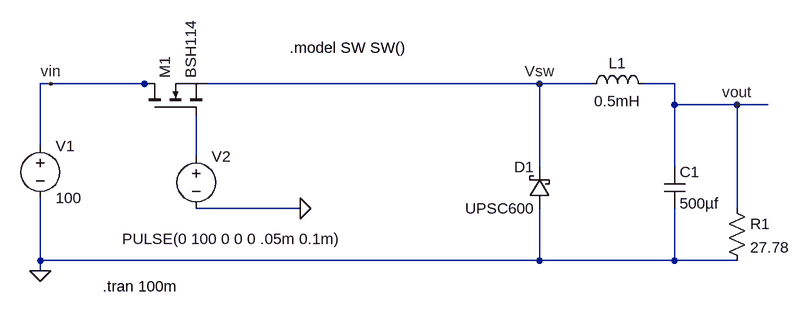
[diagram p0: schematic buck converter.asc]
buck converter.asc, the LTspice schematic file:
Version 4
SHEET 1 880 680
WIRE -1408 -1056 -1424 -1056
WIRE -1264 -1056 -1408 -1056
WIRE -1248 -1056 -1264 -1056
WIRE -656 -1056 -1168 -1056
WIRE -576 -1056 -656 -1056
WIRE -448 -1056 -496 -1056
WIRE -448 -1024 -448 -1056
WIRE -352 -1024 -448 -1024
WIRE -304 -1024 -352 -1024
WIRE -1424 -960 -1424 -1056
WIRE -1184 -944 -1184 -1008
WIRE -656 -928 -656 -1056
WIRE -448 -928 -448 -1024
WIRE -1024 -864 -1184 -864
WIRE -352 -864 -352 -1024
WIRE -1424 -784 -1424 -880
WIRE -656 -784 -656 -864
WIRE -656 -784 -1424 -784
WIRE -448 -784 -448 -864
WIRE -448 -784 -656 -784
WIRE -352 -784 -448 -784
WIRE -1424 -768 -1424 -784
FLAG -1424 -768 0
FLAG -1408 -1056 vin
FLAG -352 -1024 vout
FLAG -656 -1056 Vsw
FLAG -1024 -864 0
SYMBOL res -368 -880 R0
SYMATTR InstName R1
SYMATTR Value 27.78
SYMATTR SpiceLine tol=1 pwr=0.1
SYMBOL cap -464 -928 R0
SYMATTR InstName C1
SYMATTR Value 500µf
SYMBOL voltage -1424 -976 R0
WINDOW 123 0 0 Left 0
WINDOW 39 0 0 Left 0
SYMATTR InstName V1
SYMATTR Value 100
SYMBOL ind -592 -1040 R270
WINDOW 0 32 56 VTop 2
WINDOW 3 5 56 VBottom 2
SYMATTR InstName L1
SYMATTR Value 0.5mH
SYMBOL schottky -640 -864 R180
WINDOW 0 24 64 Left 2
WINDOW 3 24 0 Left 2
SYMATTR InstName D1
SYMATTR Value UPSC600
SYMATTR Description Diode
SYMATTR Type diode
SYMBOL voltage -1184 -960 R0
WINDOW 123 0 0 Left 0
WINDOW 39 0 0 Left 0
WINDOW 3 -114 143 Left 2
SYMATTR InstName V2
SYMATTR Value PULSE(0 100 0 0 0 .05m 0.1m)
SYMBOL nmos -1264 -1008 R270
SYMATTR InstName M1
SYMATTR Value BSH114
TEXT -1328 -744 Left 2 !.tran 100m
TEXT -1040 -1112 Left 2 !.model SW SW()

The netlist it stands for:
* buck converter.asc
R1 vout 0 27.78 tol=1 pwr=0.1
C1 vout 0 500µf
V1 vin 0 100
L1 Vsw vout 0.5mH
D1 0 Vsw UPSC600
V2 N001 0 PULSE(0 100 0 0 0 .05m 0.1m)
M1 vin N001 Vsw Vsw BSH114
.model D D
.lib standard.dio
.model NMOS NMOS
.model PMOS PMOS
.lib standard.mos
.tran 100m
.model SW SW()
.backanno
.end